# EAGLE design SyncLED (EAGLE 6.6.0)
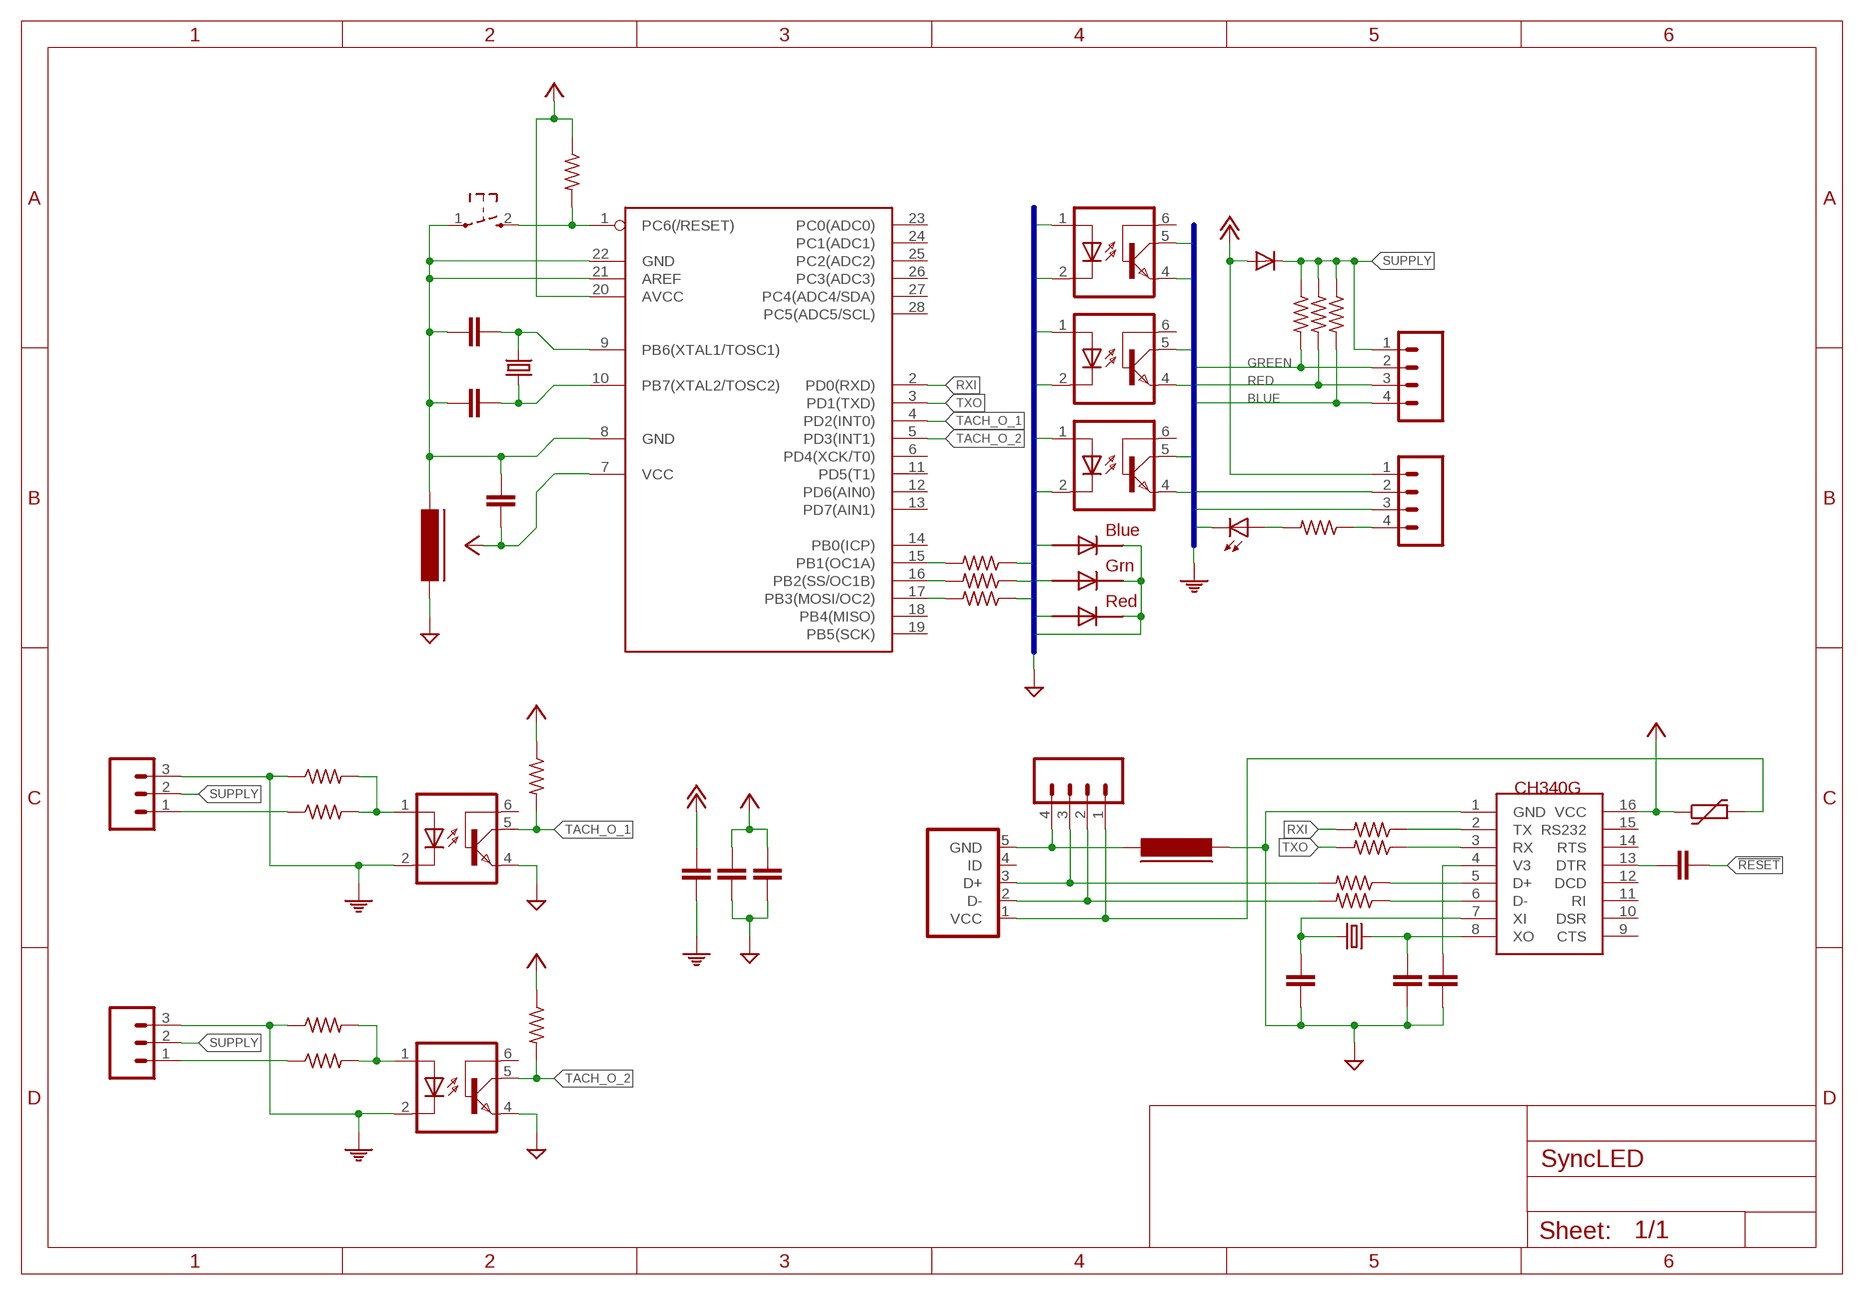
[diagram p0: schematic, sheet 1]

## Parts
!RES  SMD  SW_TACT_2P-3X6  [SW_TACT_3X6]
C1  22pF  C-EUC0805K  [C0805K]
C2  22pF  C-EUC0805K  [C0805K]
C3  22pF  C-EUC0805K  [C0805K]
C4  22pF  C-EUC0805K  [C0805K]
CAP_!DTR  100nF  C-EUC1206K  [C1206K]
CAP_BYPASS  22pF  C-EUC0805K  [C0805K]
CAP_DIGITAL_1  1uF  C-EUC1210K  [C1210K]
CAP_DIGITAL_2  1uF  C-EUC1210K  [C1210K]
CAP_LED  1uF  C-EUC1206K  [C1206K]
CAP_MCU  10uF  C-EUC1206K  [C1206K]
DIODE_LED  1N4004  [DO41-10]
FAN_HEADER_1  M03PTH  [1X03]
FAN_HEADER_2  M03PTH  [1X03]
FERRITE_MCU  UGND  FERRITE-0805  [FB805]
FERRITE_USB  UGND  FERRITE-0805  [FB805]
INDICATOR  RGBLED5050  [RGBLED5050]
LED_OUTPUT  M04PTH  [1X04]
MCU  MEGA8-P  [DIL28-3]
OPTO_BLUE  4N35  [DIL06]
OPTO_GREEN  4N35  [DIL06]
OPTO_RED  4N35  [DIL06]
OPTO_TACH_1  4N35  [DIL06]
OPTO_TACH_2  4N35  [DIL06]
POWER_INDICATOR  LEDCHIPLED_1206  [CHIPLED_1206]
PPTC  500mA  FUSE_PTC-0805  [PTC0805]
RES_B_IN  100E  R-US_0207/12  [0207/12]
RES_BLUE  10K  R-US_0207/10  [0207/10]
RES_D+  100E  R-US_M0805  [M0805]
RES_D-  100E  R-US_M0805  [M0805]
RES_G_IN  100E  R-US_0207/12  [0207/12]
RES_GREEN  10K  R-US_0207/10  [0207/10]
RES_LED  10K  R-US_M1206  [M1206]
RES_PULLUP  10K  R-US_0207/12  [0207/12]
RES_R_IN  100E  R-US_0207/12  [0207/12]
RES_RED  10K  R-US_0207/10  [0207/10]
RES_RX  100E  R-US_0207/10  [0207/10]
RES_TACH_1  100E  R-US_0207/10  [0207/10]
RES_TACH_2  100E  R-US_0207/10  [0207/10]
RES_TACH_PULLDOWN_1  1K  R-US_0207/10  [0207/10]
RES_TACH_PULLDOWN_2  1K  R-US_0207/10  [0207/10]
RES_TACH_PULLUP_1  10K  R-US_0207/10  [0207/10]
RES_TACH_PULLUP_2  10K  R-US_0207/10  [0207/10]
RES_TX  100E  R-US_0207/10  [0207/10]
SMPS_SUPPLY  M04PTH  [1X04]
USB2UART  CH340G  [SOIC16]
USB-RECEPTABLE  USB-Micro  USB-RECEPTABLE  [FCI-10103594-0001LF]
USB_PORT  M04PTH  [1X04]
XTAL_MCU  CRYSTALHC49S  [HC49/S]
XTAL_USB  CRYSTALHC49S  [HC49/S]

## Nets
3V [SMD]: CAP_BYPASS.1 USB2UART.4(V3)
!DTR [SMD]: CAP_!DTR.1 USB2UART.13(DTR)
!RESET [SMD]: !RES.2 CAP_!DTR.2 MCU.1(PC6(/RESET)) RES_PULLUP.2
+5V: CAP_DIGITAL_1.1 CAP_DIGITAL_2.1 CAP_MCU.1 MCU.7(VCC) MCU.20(AVCC) PPTC.1 RES_PULLUP.1 RES_TACH_PULLUP_1.1 RES_TACH_PULLUP_2.1 USB2UART.16(VCC)
+12V [High]: CAP_LED.1 DIODE_LED.A SMPS_SUPPLY.1
B_IN: MCU.17(PB3(MOSI/OC2)) RES_B_IN.2
B_OUT: INDICATOR.3(BLUE_A) OPTO_BLUE.1(A) RES_B_IN.1
BLUE: LED_OUTPUT.4 OPTO_BLUE.5(COL) RES_BLUE.2
DGND: C1.2 C2.2 CAP_BYPASS.2 CAP_DIGITAL_1.2 CAP_DIGITAL_2.2 FERRITE_MCU.1 FERRITE_USB.2 INDICATOR.4(BLUE_C) INDICATOR.5(RED_C) INDICATOR.6(GREEN_C) OPTO_BLUE.2(C) OPTO_GREEN.2(C) OPTO_RED.2(C) OPTO_TACH_1.4(EMI) OPTO_TACH_2.4(EMI) USB2UART.1(GND)
DI_I: RES_D+.2 USB-RECEPTABLE.3(D+) USB_PORT.3
DI_O: RES_D-.2 USB-RECEPTABLE.2(D-) USB_PORT.2
DO_N [SMD]: RES_D-.1 USB2UART.6(D-)
DO_P: RES_D+.1 USB2UART.5(D+)
G_IN: MCU.16(PB2(SS/OC1B)) RES_G_IN.2
G_OUT: INDICATOR.1(GREEN_A) OPTO_GREEN.1(A) RES_G_IN.1
GREEN: LED_OUTPUT.2 OPTO_GREEN.5(COL) RES_RED.2
GROUND: CAP_LED.2 FAN_HEADER_1.3 FAN_HEADER_2.3 OPTO_BLUE.4(EMI) OPTO_GREEN.4(EMI) OPTO_RED.4(EMI) OPTO_TACH_1.2(C) OPTO_TACH_2.2(C) POWER_INDICATOR.C RES_TACH_PULLDOWN_1.1 RES_TACH_PULLDOWN_2.1 SMPS_SUPPLY.2 SMPS_SUPPLY.3 ; supply symbol labelled LED_GROUND
LED_SUPPLY: POWER_INDICATOR.A RES_LED.2
MCU_GND: !RES.1 C3.1 C4.1 CAP_MCU.2 FERRITE_MCU.2 MCU.8(GND) MCU.21(AREF) MCU.22(GND)
MCU_XI [Special]: C3.2 MCU.9(PB6(XTAL1/TOSC1)) XTAL_MCU.2
MCU_XO [Special]: C4.2 MCU.10(PB7(XTAL2/TOSC2)) XTAL_MCU.1
R_IN: MCU.15(PB1(OC1A)) RES_R_IN.2
R_OUT: INDICATOR.2(RED_A) OPTO_RED.1(A) RES_R_IN.1
RED: LED_OUTPUT.3 OPTO_RED.5(COL) RES_GREEN.2
RXI: MCU.2(PD0(RXD)) RES_TX.2
RXO [SMD]: RES_RX.1 USB2UART.3(RX)
SUPPLY [High]: DIODE_LED.C FAN_HEADER_1.2 FAN_HEADER_2.2 LED_OUTPUT.1 RES_BLUE.1 RES_GREEN.1 RES_RED.1
SUPPLY_5V: RES_LED.1 SMPS_SUPPLY.4
TACH_IN_1: FAN_HEADER_1.1 RES_TACH_1.1
TACH_IN_2: FAN_HEADER_2.1 RES_TACH_2.1
TACH_O_1: MCU.4(PD2(INT0)) OPTO_TACH_1.5(COL) RES_TACH_PULLUP_1.2
TACH_O_2: MCU.5(PD3(INT1)) OPTO_TACH_2.5(COL) RES_TACH_PULLUP_2.2
TACH_OPTO_1: OPTO_TACH_1.1(A) RES_TACH_1.2 RES_TACH_PULLDOWN_1.2
TACH_OPTO_2: OPTO_TACH_2.1(A) RES_TACH_2.2 RES_TACH_PULLDOWN_2.2
TXI [SMD]: RES_TX.1 USB2UART.2(TX)
TXO: MCU.3(PD1(TXD)) RES_RX.2
USB_GND: FERRITE_USB.1 USB-RECEPTABLE.5(GND) USB_PORT.4
USB_XI [SMD]: C2.1 USB2UART.7(XI) XTAL_USB.1
USB_XO [SMD]: C1.1 USB2UART.8(XO) XTAL_USB.2
VUSB [High]: PPTC.2 USB-RECEPTABLE.1(VCC) USB_PORT.1
Unconnected: MCU.6(PD4(XCK/T0)) MCU.11(PD5(T1)) MCU.12(PD6(AIN0)) MCU.13(PD7(AIN1)) MCU.14(PB0(ICP)) MCU.18(PB4(MISO)) MCU.19(PB5(SCK)) MCU.23(PC0(ADC0)) MCU.24(PC1(ADC1)) MCU.25(PC2(ADC2)) MCU.26(PC3(ADC3)) MCU.27(PC4(ADC4/SDA)) MCU.28(PC5(ADC5/SCL)) OPTO_BLUE.6(BAS) OPTO_GREEN.6(BAS) OPTO_RED.6(BAS) OPTO_TACH_1.6(BAS) OPTO_TACH_2.6(BAS) USB2UART.9(CTS) USB2UART.10(DSR) USB2UART.11(RI) USB2UART.12(DCD) USB2UART.14(RTS) USB2UART.15(RS232) USB-RECEPTABLE.4(ID)

## Buses
R_OUT,G_OUT,B_OUT,DGND
RED,GREEN,BLUE,GROUND

## Library data of the parts
!RES = dp_devices:SW_TACT_2P
C1-C4 CAP_!DTR CAP_BYPASS CAP_DIGITAL_1 CAP_DIGITAL_2 CAP_LED CAP_MCU = rcl:C-EU: CAPACITOR, European symbol
DIODE_LED = lasser:1N4004: DIODE general purpose rectifier, 1 A
FAN_HEADER_1 FAN_HEADER_2 = SparkFun:M03: Header 3 Standard 3-pin 0.1" header. Use with straight break away headers (SKU : PRT-00116), right angle break away headers (PRT-00553), swiss pins (PRT-00743), machine pins (PRT-00117), and female headers (PRT-00115). Molex polarized connector foot print use with SKU : PRT-08232 with associated crimp pins and housings.
FERRITE_MCU FERRITE_USB = dp_devices:FERRITE: Ferrite bead in various packages
INDICATOR = adafruit:RGBLED: For 5050 RGB LEDs, the order of the LEDs may vary from one manufacturer to another!
LED_OUTPUT SMPS_SUPPLY = SparkFun-Connectors:M04: Header 4 Standard 4-pin 0.1" header. Use with straight break away headers (SKU : PRT-00116), right angle break away headers (PRT-00553), swiss pins (PRT-00743), machine pins (PRT-00117), and female headers (PRT-00115). Molex polarized connector foot print use with SKU : PRT-08231 with associated ...
MCU = atmel:MEGA8-P: MICROCONTROLLER 8 Kbytes FLASH, 1 kbytes SRAM, 512 bytes EEPROM, USART, 4-channel 10 bit ADC, 2-channel 8 bit ADC Pin compatible with Atmega48, ATMega88, ATMega168 Source: avr.lbr; OC_FARNELL: unknown; OC_NEWARK: unknown
OPTO_BLUE OPTO_GREEN OPTO_RED OPTO_TACH_1 OPTO_TACH_2 = optocoupler:4N35: MOTOROLA OPTO COUPLER; MF: FAIRCHILD SEMICONDUCTOR; MPN: 4N35; OC_FARNELL: 1328375; OC_NEWARK: 72K9946
POWER_INDICATOR = adafruit_alt:LED: LED OSRAM: - CHIPLED LG R971, LG N971, LY N971, LG Q971, LY Q971, LO R971, LY R971 LH N974, LH R974 LS Q976, LO Q976, LY Q976 LO Q996 - Hyper CHIPLED LW Q18S LB Q993, LB Q99A, LB R99A - SideLED LS A670, LO A670, LY A670, LG A670, LP A670 LB A673, LV A673, LT A673, LW A673 LH A674 LY A675 LS A676, LA A676, LO A676, LY A676, LW A676 LS A679, LY A679, LG A679 - Hyper Micro SIDELED® LS Y876, LA Y876, LO Y876, LY Y876 LT Y87S - SmartLED LW L88C, LW L88S LB L89C, LB L89S, LG L890 LS L89K, LO L89K, LY L89K LS L896, LA L896, LO L896, LY L896 - TOPLED LS T670, LO T670, LY T670, LG T670, LP T670 LSG T670, LSP T670, LSY T670, LOP T670, LYG T670 LG T671, LOG T671, LSG T671 LB T673, LV T673, LT T673, LW T673 LH T674 LS T676, LA T676, LO T676, LY T676, LB T676, LH T676, LSB T676, LW T676 LB T67C, LV T67C, LT T67C, LS T67K, LO T67K, LY T67K, LW E67C LS E67B, LA E67B, LO E67B, LY E67B, LB E67C, LV E67C, LT E67C LW T67C LS T679, LY T679, LG T679 LS T770, LO T770, LY T770, LG T770, LP T770 LB T773, LV T773, LT T773, LW T773 LH T774 LS E675, LA E675, LY E675, LS T675 LS T776, LA T776, LO T776, LY T776, LB T776 LHGB T686 LT T68C, LB T68C - Hyper Mini TOPLED® LB M676 - Mini TOPLED Santana® LG M470 LS M47K, LO M47K, LY M47K Source: http://www.osram.convergy.de/
PPTC = dp_devices:FUSE_PTC: Resettable PTC
RES_B_IN RES_BLUE RES_D+ RES_D- RES_G_IN RES_GREEN RES_LED RES_PULLUP RES_R_IN RES_RED RES_RX RES_TACH_1 RES_TACH_2 RES_TACH_PULLDOWN_1 RES_TACH_PULLDOWN_2 RES_TACH_PULLUP_1 RES_TACH_PULLUP_2 RES_TX = rcl:R-US_: RESISTOR, American symbol
USB2UART = usb-serial:CH340G
USB-RECEPTABLE = daspilker:USB-RECEPTABLE: USB Receptable
USB_PORT = SparkFun:M04: Header 4 Standard 4-pin 0.1" header. Use with straight break away headers (SKU : PRT-00116), right angle break away headers (PRT-00553), swiss pins (PRT-00743), machine pins (PRT-00117), and female headers (PRT-00115). Molex polarized connector foot print use with SKU : PRT-08231 with associated ...
XTAL_MCU XTAL_USB = crystal:CRYSTAL: CRYSTAL; OC_FARNELL: 1667008; OC_NEWARK: unknown

## Board
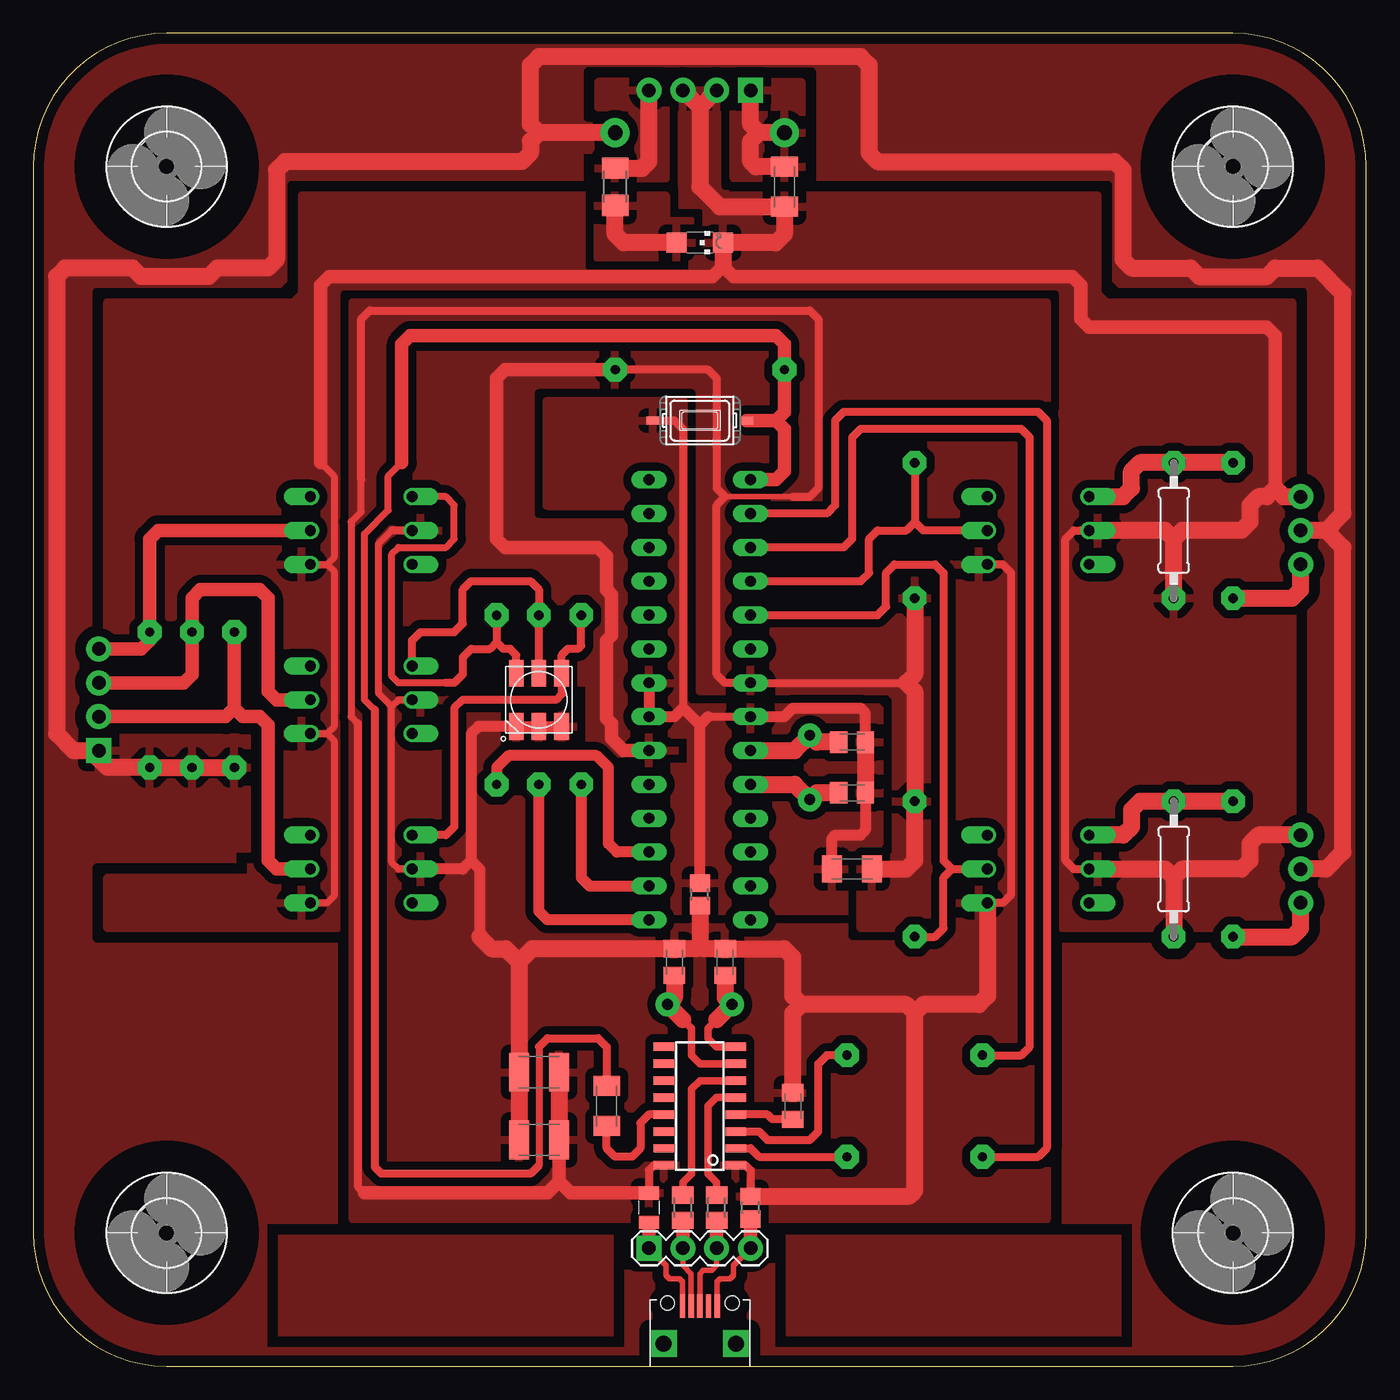
[diagram p1: board, top side]
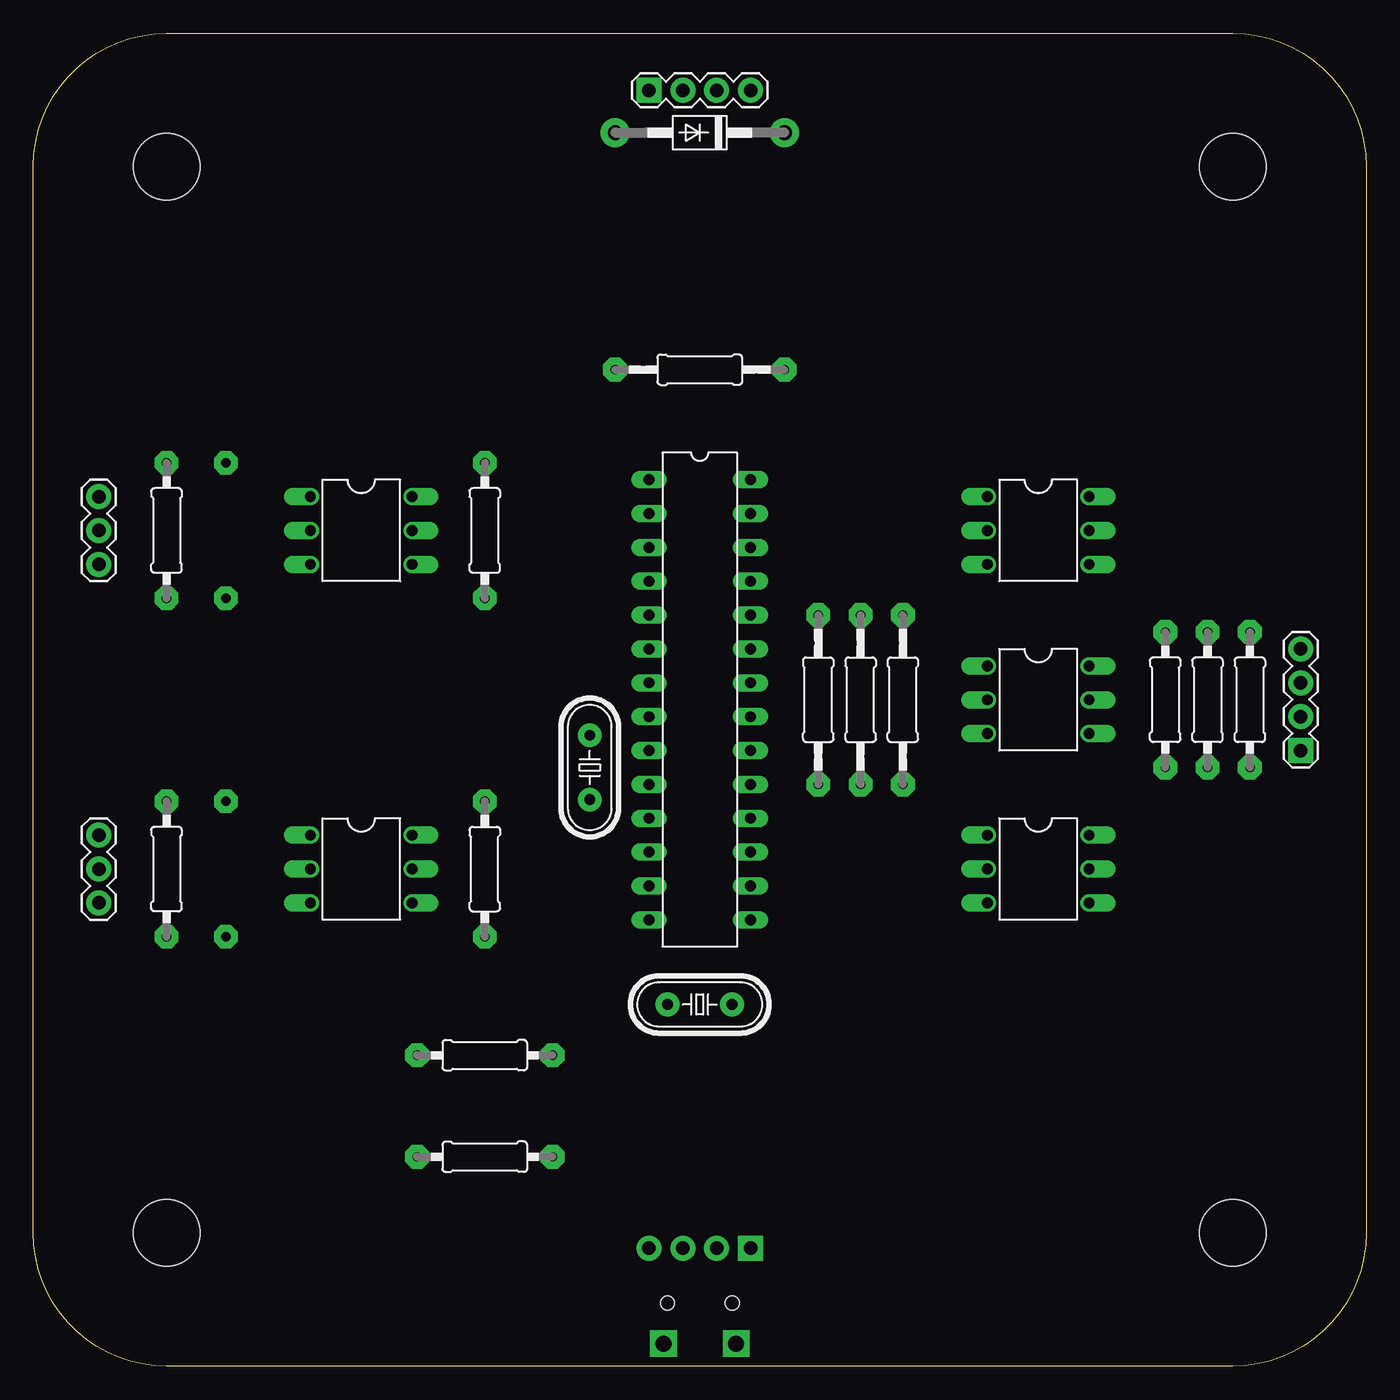
[diagram p2: board, bottom side, seen from below]

Size 100 x 100 mm. Coordinates in mm from the lower left corner, seen from the top.
Outline: 0,10 arc90 10,0 90,0 arc90 100,10 100,90 arc90 90,100 10,100 arc90 0,90 0,10
Copper layers (1*16): Top 0.035mm / dielectric 1.5mm / Bottom 0.035mm
Design rules "Manual *": minimum track width 16mil, minimum drill 20mil, track to track 16mil, track to pad 16mil, pad to pad 16mil, via to via 12mil, smd to smd 8mil, copper to edge 32mil, drill to drill 16mil, minimum pad ring 10mil, minimum via ring 8mil, stop-mask expansion 4mil, vias tented up to drill 0mil, thermal gap 24mil

### Footprints (pad centres in the part's own frame; a part is rotated, then mirrored left to right if it is on the bottom)
SW_TACT_3X6 = smd 1 x 0.6: 1 -3.5,0; 2 3.5,0
C0805K = smd 1.3 x 1.6: 1 -1,0; 2 1,0
C1206K = smd 1.5 x 2: 1 -1.5,0; 2 1.5,0
C1210K = smd 1.5 x 2.9: 1 -1.5,0; 2 1.5,0
DO41-10 = drill 1.1 pad 2.184: A 6.35,0; C -6.35,0
1X03 = drill 1.016 pad 1.88: 1 0,0; 2 2.54,0; 3 5.08,0
FB805 = smd 1.3 x 1.5: 1 -0.85,0; 2 0.85,0
RGBLED5050 = smd 2 x 1.1: 1 -2,1.7; 2 -2,0; 3 -2,-1.7; 4 2,-1.7; 5 2,0; 6 2,1.7
1X04 = drill 1.016 pad 1.88 square: 1 0,0 | drill 1.016 pad 1.88: 2 2.54,0; 3 5.08,0; 4 7.62,0
DIL28-3 = drill 0.813 long: 1 -16.51,-3.81; 2 -13.97,-3.81; 3 -11.43,-3.81; 4 -8.89,-3.81; 5 -6.35,-3.81; 6 -3.81,-3.81; 7 -1.27,-3.81; 8 1.27,-3.81; 9 3.81,-3.81; 10 6.35,-3.81; 11 8.89,-3.81; 12 11.43,-3.81; 13 13.97,-3.81; 14 16.51,-3.81; 15 16.51,3.81; 16 13.97,3.81; 17 11.43,3.81; 18 8.89,3.81; 19 6.35,3.81; 20 3.81,3.81; 21 1.27,3.81; 22 -1.27,3.81; 23 -3.81,3.81; 24 -6.35,3.81; 25 -8.89,3.81; 26 -11.43,3.81; 27 -13.97,3.81; 28 -16.51,3.81
DIL06 = drill 0.813 offset: 1 -2.54,-3.81; 2 0,-3.81; 3 2.54,-3.81; 4 2.54,3.81; 5 0,3.81; 6 -2.54,3.81
CHIPLED_1206 = smd 1.5 x 1.5: A 0,-1.75; C 0,1.75
PTC0805 = smd 1 x 1.5: 1 -1.1,0; 2 1.1,0
0207/12 = drill 0.7 pad 1.778 octagon: 1 -6.35,0; 2 6.35,0
0207/10 = drill 0.7 pad 1.778 octagon: 1 -5.08,0; 2 5.08,0
M0805 = smd 1.3 x 1.6: 1 -0.95,0; 2 0.95,0
M1206 = smd 1.6 x 2: 1 -1.4,0; 2 1.4,0
5,0 = hole 5: 0,0
SOIC16 = smd 0.635 x 1.524: 1 -4.445,-2.695; 2 -3.175,-2.695; 3 -1.905,-2.695; 4 -0.635,-2.695; 5 0.635,-2.695; 6 1.905,-2.695; 7 3.175,-2.695; 8 4.445,-2.695; 9 4.445,2.695; 10 3.175,2.695; 11 1.905,2.695; 12 0.635,2.695; 13 -0.635,2.695; 14 -1.905,2.695; 15 -3.175,2.695; 16 -4.445,2.695
FCI-10103594-0001LF = smd 0.4 x 1.75: 1 -1.3,4.525; 2 -0.65,4.525; 3 0,4.525; 4 0.65,4.525; 5 1.3,4.525 | drill 1.2 pad 2 square: P$3 -2.725,1.7; P$4 2.725,1.7 | hole 1.05: -2.425,4.73; 2.425,4.73
HC49/S = drill 0.813 pad 1.778: 1 -2.413,0; 2 2.413,0

### Placement (x,y rotation side)
!RES  50,70.95 0 top
C1  51.91,30.31 90 top
C2  48.1,30.31 90 top
C3  61.43,46.83 180 top
C4  61.43,43.02 180 top
CAP_!DTR  43.02,19.52 90 top
CAP_BYPASS  56.98,19.52 90 top
CAP_DIGITAL_1  37.94,22.06 180 top
CAP_DIGITAL_2  37.94,16.98 180 top
CAP_LED  56.35,88.48 270 top
CAP_MCU  61.43,37.3 180 top
DIODE_LED  50,92.55 180 bottom
FAN_HEADER_1  95.09,60.16 90 bottom
FAN_HEADER_2  95.09,34.76 90 bottom
FERRITE_MCU  50,35.4 90 top
FERRITE_USB  53.81,11.9 90 top
INDICATOR  37.94,50 270 top
LED_OUTPUT  4.92,46.19 90 bottom
MCU  50,50 270 bottom
OPTO_BLUE  24.6,62.7 270 bottom
OPTO_GREEN  24.6,37.3 270 bottom
OPTO_RED  24.6,50 270 bottom
OPTO_TACH_1  75.4,62.7 270 bottom
OPTO_TACH_2  75.4,37.3 270 bottom
POWER_INDICATOR  50,84.29 270 top
PPTC  46.19,11.9 270 top
RES_B_IN  34.76,50 270 bottom
RES_BLUE  8.72,50 90 bottom
RES_D+  51.27,11.9 270 top
RES_D-  48.73,11.9 270 top
RES_G_IN  41.11,50 270 bottom
RES_GREEN  11.9,50 90 bottom
RES_LED  43.65,88.48 270 top
RES_PULLUP  50,74.77 180 bottom
RES_R_IN  37.94,50 270 bottom
RES_RED  15.07,50 90 bottom
RES_RX  66.13,23.33 180 bottom
RES_TACH_1  90.01,62.7 90 bottom
RES_TACH_2  90.01,37.3 90 bottom
RES_TACH_PULLDOWN_1  85.56,62.7 90 top
RES_TACH_PULLDOWN_2  85.56,37.3 90 top
RES_TACH_PULLUP_1  66.13,62.7 90 bottom
RES_TACH_PULLUP_2  66.13,37.3 270 bottom
RES_TX  66.13,15.71 180 bottom
SMPS_SUPPLY  53.81,95.72 0 bottom
U$1  [5,0]  90,10 0 top
U$2  [5,0]  90,90 0 top
U$3  [5,0]  10,90 0 top
U$5  [5,0]  10,10 0 top
USB2UART  50,19.52 90 top
USB-RECEPTABLE  50,0 0 top
USB_PORT  46.19,8.85 0 top
XTAL_MCU  58.26,44.92 90 bottom
XTAL_USB  50,27.14 180 bottom

### Tracks (layer width: path | path; a pad name or v marks a point on that pad's centre or on a via)
3V
  Top 0.61: CAP_BYPASS.1 55.45,18.52 55.08,18.88 USB2UART.4
!DTR
  Top 0.61: USB2UART.13 46.19,18.88 45.55,18.25 45.55,16.34 44.92,15.71 43.65,15.71 43.02,16.34 CAP_!DTR.1
!RESET
  Top 0.508: 37.94,23.96 37.94,15.07 | 25.62,49.24 24.85,50 24.85,62.45 26.63,64.22 26.63,66.76 27.65,67.78
  Top 0.61: 37.94,23.96 38.57,24.6 42.38,24.6 43.02,23.96 CAP_!DTR.2 | 37.94,15.07 37.3,14.44 26.12,14.44 25.62,14.95 25.62,49.24
  Top 1.016: 55.72,70.95 56.35,71.59 RES_PULLUP.2 56.35,76.67 55.72,77.31 28.28,77.31 27.65,76.67 27.65,67.78 | 55.72,70.95 !RES.2 | MCU.1 55.72,66.51 56.35,67.14 56.35,70.32 55.72,70.95
+5V
  Top 0.406: 51.91,65.24 56.98,65.24
  Top 0.508: 24.35,48.22 23.84,48.73 23.84,63.34 24.6,64.1 24.6,66.51
  Top 0.61: USB2UART.16 46.57,15.07 46.19,14.69 PPTC.1 | 65.49,51.27 MCU.7 51.91,51.27 51.27,51.91 51.27,64.61 51.91,65.24 51.27,65.88 51.27,74.13 50.64,74.77 RES_PULLUP.1 | 24.6,66.51 24.6,78.58 25.23,79.21 58.26,79.21 58.89,78.58 58.89,65.88 58.26,65.24 56.98,65.24 | 24.35,48.22 24.35,13.51 24.85,13
  Top 1.016: 24.85,13 38.57,13 39.44,13.86 | CAP_DIGITAL_2.1 39.44,13.86 | PPTC.1 40.3,13 39.44,13.86 | MCU.20 44.29,46.19 43.4,47.08 43.4,48.22 43.02,48.6 43.02,54.45 43.4,54.83 43.4,57.87 43.02,58.26 43.02,60.8 42.38,61.43 35.4,61.43 34.76,62.07 34.76,74.13 35.4,74.77 RES_PULLUP.1
  Top 1.27: CAP_DIGITAL_1.1 CAP_DIGITAL_2.1 | RES_TACH_PULLUP_1.1 66.13,51.91 65.49,51.27 66.13,50.64 RES_TACH_PULLUP_2.1 66.13,37.94 65.49,37.3 CAP_MCU.1
  pour Top (isolate 0.61): 48.73,11.01 23.96,11.01 23.96,79.84 76.03,79.84 76.03,70.32 66.13,70.32 66.13,62.7 62.7,62.7 62.7,60.16 68.29,60.16 68.29,32.86 62.07,32.86 62.07,37.94 64.22,37.94 64.73,38.44 64.73,50.13 64.22,50.64 50,50.64 50,72.99 arc90 49.37,73.62 37.94,73.62 arc90 37.3,72.99 37.3,63.97 arc90 37.94,63.34 44.29,63.34 44.29,47.46 48.1,47.46 48.1,44.92 41.75,44.92 41.75,51.27 24.6,51.27 24.6,14.44 38.57,14.44 38.57,23.96 41.75,23.96 41.75,16.34 arc90 43.02,15.07 48.73,15.07
+12V
  Top 1.27: CAP_LED.1 54.22,89.98 53.81,90.39 53.81,91.91 54.45,92.55 | SMPS_SUPPLY.1 53.81,93.18 54.45,92.55 | DIODE_LED.A 54.45,92.55
  pour Top (isolate 0.635): 52.54,96.36 57.62,96.36 57.62,89.12 52.54,89.12
B_IN
  Top 0.813: MCU.17 43.78,38.57 43.14,39.21 43.14,44.92 42.25,45.81 35.65,45.81 34.76,44.92 RES_B_IN.2
B_OUT
  Top 0.508: OPTO_BLUE.1 30.95,65.24 31.58,64.61 31.58,62.07 30.95,61.43 27.39,61.43 26.89,60.92 26.89,51.78 27.39,51.27 30.95,51.27
  Top 0.61: INDICATOR.3 36.23,53.35 35.78,53.81 35.27,53.81 34.76,54.32 | 30.95,51.27 31.58,51.27 32.22,51.91 32.22,53.18 32.86,53.81 34.25,53.81 34.76,54.32 | RES_B_IN.1 34.76,54.32
BLUE
  Top 1.016: LED_OUTPUT.4 8.09,53.81 8.72,54.45 RES_BLUE.2 8.72,62.07 9.36,62.7 OPTO_BLUE.5
COPYRIGHT
  pour Top: 56.48,2.25 56.48,9.87 81.62,9.87 81.62,2.25
DGND
  Top 0.508: OPTO_RED.2 27.39,50 26.89,49.49 | 26.89,62.7 25.87,61.68 25.87,50.51 26.89,49.49 | OPTO_GREEN.2 27.39,37.3 26.89,37.81 26.89,49.49
  Top 0.61: USB2UART.1 53.43,15.07 53.81,14.69 FERRITE_USB.2 | OPTO_TACH_2.4 72.73,34.76 73.37,35.4 73.37,59.53 72.73,60.16 OPTO_TACH_1.4 72.23,60.16 | OPTO_BLUE.2 26.89,62.7
  Top 0.813: INDICATOR.6 INDICATOR.5 INDICATOR.4 33.4,48 32.86,47.46 32.86,37.94 | OPTO_GREEN.2 32.22,37.3 32.86,37.94 | 32.86,37.94 33.49,37.3 33.49,32.22
  Top 1.27: 36.44,30.31 CAP_DIGITAL_1.2 CAP_DIGITAL_2.2 | FERRITE_MCU.1 50,31.58 | 50,31.58 49.73,31.32 C2.2 37.44,31.32 36.44,30.31 | 50,31.58 50.27,31.32 C1.2 56.35,31.32 56.98,30.68 56.98,27.77 57.62,27.14 | OPTO_TACH_2.4 71.59,27.77 70.95,27.14 66.76,27.14 66.13,26.5 | 57.62,27.14 65.49,27.14 66.13,26.5 | CAP_BYPASS.2 56.98,26.5 57.62,27.14 | FERRITE_USB.2 65.71,12.75 66.13,13.17 66.13,26.5 | 36.44,30.31 35.44,31.32 34.4,31.32 33.49,32.22
  pour Top (isolate 0.61, rank 3): 25.62,11.01 25.62,79.84 76.03,79.84 76.03,11.01
DI_I
  Top 0.406: USB_PORT.3 51.27,7.57 50.9,7.2 50.25,7.2 50,6.95 USB-RECEPTABLE.3
  Top 1.016: RES_D+.2 USB_PORT.3
DI_O
  Top 0.406: USB_PORT.2 48.73,7.57 49.35,6.95 USB-RECEPTABLE.2
  Top 1.016: RES_D-.2 USB_PORT.2
DO_N
  Top 0.559: RES_D-.1 48.73,13.8 49.37,14.44 49.37,20.79 50,21.43 USB2UART.6
DO_P
  Top 0.559: RES_D+.1 51.27,13.8 50.64,14.44 50.64,19.52 51.27,20.15 USB2UART.5
G_IN
  Top 0.813: RES_G_IN.2 41.11,36.67 41.75,36.03 MCU.16
G_OUT
  Top 0.61: OPTO_GREEN.1 30.95,39.84 31.58,40.48 31.58,49.37 32.22,50 39.21,50 39.64,50.43 INDICATOR.1 39.64,53.35 40.09,53.81 40.86,53.81 41.11,54.06 RES_G_IN.1
GREEN
  Top 1.016: OPTO_GREEN.5 18.25,37.3 17.61,37.94 17.61,48.1 16.98,48.73 15.71,48.73 15.07,49.37 | 15.07,49.37 14.44,48.73 LED_OUTPUT.2 | 15.07,49.37 RES_RED.2
GROUND
  Top 0.508: OPTO_GREEN.4 22.06,34.76 22.57,35.27 22.57,46.95 22.06,47.46 | OPTO_BLUE.4 22.06,60.16 | 22.06,60.16 22.57,59.65 22.57,47.97 22.06,47.46 | 22.06,60.16 22.57,60.67 22.57,66.76 21.55,67.78 | OPTO_RED.4 22.06,47.46
  Top 0.61: 78.58,62.7 OPTO_TACH_1.2 78.07,62.7 77.43,62.07 77.43,37.94 78.07,37.3 OPTO_TACH_2.2
  Top 1.016: 93.18,65.88 93.18,77.31 92.55,77.94 79.21,77.94 78.58,78.58 78.58,81.12 77.94,81.75 52.54,81.75 51.75,82.54 50.96,81.75 22.19,81.75 21.55,81.12 21.55,67.78
  Top 1.27: 50,94.45 50,88.48 51.5,86.98 CAP_LED.2 56.35,84.92 55.72,84.29 POWER_INDICATOR.C 51.75,82.54 | 50,94.45 SMPS_SUPPLY.2 | 50,94.45 SMPS_SUPPLY.3 | FAN_HEADER_1.3 93.81,65.24 93.18,65.88 92.55,65.24 91.91,65.24 91.28,64.61 91.28,63.34 90.64,62.7 86.2,62.7 85.56,62.07 | OPTO_TACH_1.2 84.92,62.7 85.56,62.07 | RES_TACH_PULLDOWN_1.1 85.56,62.07 | OPTO_TACH_2.2 84.92,37.3 85.56,36.67 | 85.56,36.67 RES_TACH_PULLDOWN_2.1 | FAN_HEADER_2.3 91.91,39.84 91.28,39.21 91.28,37.94 90.64,37.3 86.2,37.3 85.56,36.67
  pour Top (isolate 0.61, rank 4): 48.1,96.36 51.91,96.36 51.91,87.85 79.84,87.85 79.84,80.48 80.48,79.84 94.45,79.84 94.45,32.86 77.18,32.86 77.18,79.84 22.82,79.84 22.82,32.86 5.55,32.86 5.55,36.67 16.34,36.67 16.34,46.83 5.55,46.83 5.55,79.84 19.52,79.84 20.15,80.48 20.15,87.85 48.1,87.85
LED_SUPPLY
  Top 1.27: POWER_INDICATOR.A 44.29,84.29 43.65,84.92 RES_LED.2
  pour Top (isolate 0.61, rank 2): 42.38,87.85 47.46,87.85 47.46,85.94 49.37,85.94 49.37,83.02 42.38,83.02
MCU_GND
  Top 0.61: !RES.1 48.1,70.95 48.73,70.32 48.73,49.37 | 50.64,48.73 MCU.8
  Top 0.813: MCU.22 MCU.21 48.1,48.73 48.73,49.37 50,48.1 | FERRITE_MCU.2 50,48.1 | 50,48.1 50.64,48.73 | MCU.8 56.35,48.73 56.98,49.37 62.07,49.37 62.43,49 C3.1 | CAP_MCU.2 59.93,39.61 60.16,39.84 62.07,39.84 62.43,40.21 C4.1
  Top 1.27: C3.1 C4.1
  pour Top (isolate 0.61, rank 2): 37.3,72.99 arc-90 37.94,73.62 49.37,73.62 arc-90 50,72.99 50,50.64 64.22,50.64 64.73,50.13 64.73,38.44 64.22,37.94 62.07,37.94 62.07,34.12 48.1,34.12 48.1,47.46 44.29,47.46 44.29,63.34 37.94,63.34 arc-90 37.3,63.97
MCU_XI
  Top 1.27: MCU.9 57.11,46.19 XTAL_MCU.2 58.76,46.83 C3.2
MCU_XO
  Top 1.27: MCU.10 57.11,43.65 XTAL_MCU.1 58.76,43.02 C4.2
NAME
  pour Top: 18.38,2.25 18.38,9.87 43.52,9.87 43.52,2.25
R_IN
  Top 0.813: MCU.15 38.57,33.49 37.94,34.12 RES_R_IN.2
R_OUT
  Top 0.61: OPTO_RED.1 28.41,54.45 29.04,55.08 31.58,55.08 32.22,55.72 32.22,58.26 32.86,58.89 37.3,58.89 37.94,58.26 RES_R_IN.1 INDICATOR.2
RED
  Top 1.016: OPTO_RED.5 18.25,50 17.61,50.64 17.61,57.62 16.98,58.26 12.54,58.26 11.9,57.62 RES_GREEN.2 11.9,51.91 11.26,51.27 LED_OUTPUT.3
RXI
  Top 0.61: MCU.2 59.53,63.97 60.16,64.61 60.16,70.95 60.8,71.59 75.4,71.59 76.03,70.95 76.03,16.34 75.4,15.71 RES_TX.2
RXO
  Top 0.61: USB2UART.3 54.45,17.61 55.08,16.98 58.26,16.98 58.89,17.61 58.89,22.7 59.53,23.33 RES_RX.1
SUPPLY
  Top 1.27: 96.99,62.7 98.26,61.43 98.26,38.57 96.99,37.3 FAN_HEADER_2.2 | 96.99,62.7 98.26,63.97 98.26,80.48 96.36,82.39 93.18,82.39 92.55,81.75 87.47,81.75 86.83,82.39 82.39,82.39 81.75,83.02 81.75,89.75 81.12,90.39 63.34,90.39 62.7,91.02 62.7,97.62 62.07,98.26 37.94,98.26 37.3,97.62 37.3,93.18 37.94,92.55 | 37.94,92.55 37.3,91.91 37.3,91.02 36.67,90.39 18.88,90.39 18.25,89.75 18.25,83.02 17.61,82.39 13.8,82.39 13.17,81.75 8.09,81.75 7.46,82.39 2.38,82.39 1.74,81.75 1.74,47.46 3.01,46.19 LED_OUTPUT.1 4.92,45.55 5.55,44.92 RES_BLUE.1 RES_GREEN.1 RES_RED.1 | DIODE_LED.C 37.94,92.55 | 96.99,62.7 FAN_HEADER_1.2
  pour Top (isolate 0.813, rank 5): -0.8,100.8 100.8,100.8 100.8,-0.8 -0.8,-0.8
SUPPLY_5V
  Top 1.27: RES_LED.1 45.69,89.88 46.19,90.39 SMPS_SUPPLY.4
  pour Top (isolate 0.61): 42.38,89.12 47.46,89.12 47.46,96.36 42.38,96.36 42.38,94.45 44.92,94.45 44.92,90.39 42.38,90.39
TACH_IN_1
  Top 1.27: RES_TACH_1.1 94.45,57.62 95.09,58.26 FAN_HEADER_1.1
TACH_IN_2
  Top 1.27: RES_TACH_2.1 94.45,32.22 95.09,32.86 FAN_HEADER_2.1
TACH_O_1
  Top 0.61: MCU.4 62.07,58.89 62.7,59.53 62.7,62.07 63.34,62.7 65.49,62.7 66.13,63.34 | RES_TACH_PULLUP_1.2 66.13,63.34 | OPTO_TACH_1.5 66.76,62.7 66.13,63.34
TACH_O_2
  Top 0.61: MCU.5 63.34,56.35 63.97,56.98 63.97,59.53 64.61,60.16 67.65,60.16 68.29,59.53 68.29,37.94 68.92,37.3 | 68.92,37.3 OPTO_TACH_2.5 | RES_TACH_PULLUP_2.2 67.65,32.22 68.29,32.86 68.29,36.67 68.92,37.3
TACH_OPTO_1
  Top 1.27: RES_TACH_1.2 RES_TACH_PULLDOWN_1.2 83.02,67.78 82.39,67.14 82.39,65.88 81.75,65.24 OPTO_TACH_1.1
TACH_OPTO_2
  Top 1.27: RES_TACH_2.2 RES_TACH_PULLDOWN_2.2 83.02,42.38 82.39,41.75 82.39,40.48 81.75,39.84 OPTO_TACH_2.1
TXI
  Top 0.61: USB2UART.2 53.81,16.34 54.45,15.71 RES_TX.1
TXO
  Top 0.61: MCU.3 60.8,61.43 61.43,62.07 61.43,69.69 62.07,70.32 74.13,70.32 74.77,69.69 74.77,23.96 74.13,23.33 RES_RX.2
USB_GND
  Top 0.406: USB_PORT.4 52.54,7.58 52.54,6.82 52.29,6.57 51.52,6.57 51.3,6.34 USB-RECEPTABLE.5
  Top 1.016: FERRITE_USB.1 USB_PORT.4
USB_XI
  Top 0.559: USB2UART.7 50,22.7 49.37,23.33 49.37,25.36 48.73,26
  Top 1.27: C2.1 48.1,27.65 XTAL_USB.1 48.73,26
USB_XO
  Top 0.559: USB2UART.8 51.27,23.96 50.64,24.6 50.64,25.36 51.27,26
  Top 1.27: C1.1 51.91,27.65 XTAL_USB.2 51.27,26
VUSB
  Top 0.406: USB_PORT.1 47.46,7.58 47.46,6.82 47.71,6.57 48.48,6.57 48.7,6.34 USB-RECEPTABLE.1
  Top 1.016: PPTC.2 USB_PORT.1

### Text on the board
tRestrict: Designed by: / Sandeepan Sengupta / + Tamojit Saha | CopyRight (C) 2016 / Intelectron India / > intelectron.in <